# Altium schematic sheet Digital_CPLD.SchDoc
size 381 x 381 mm
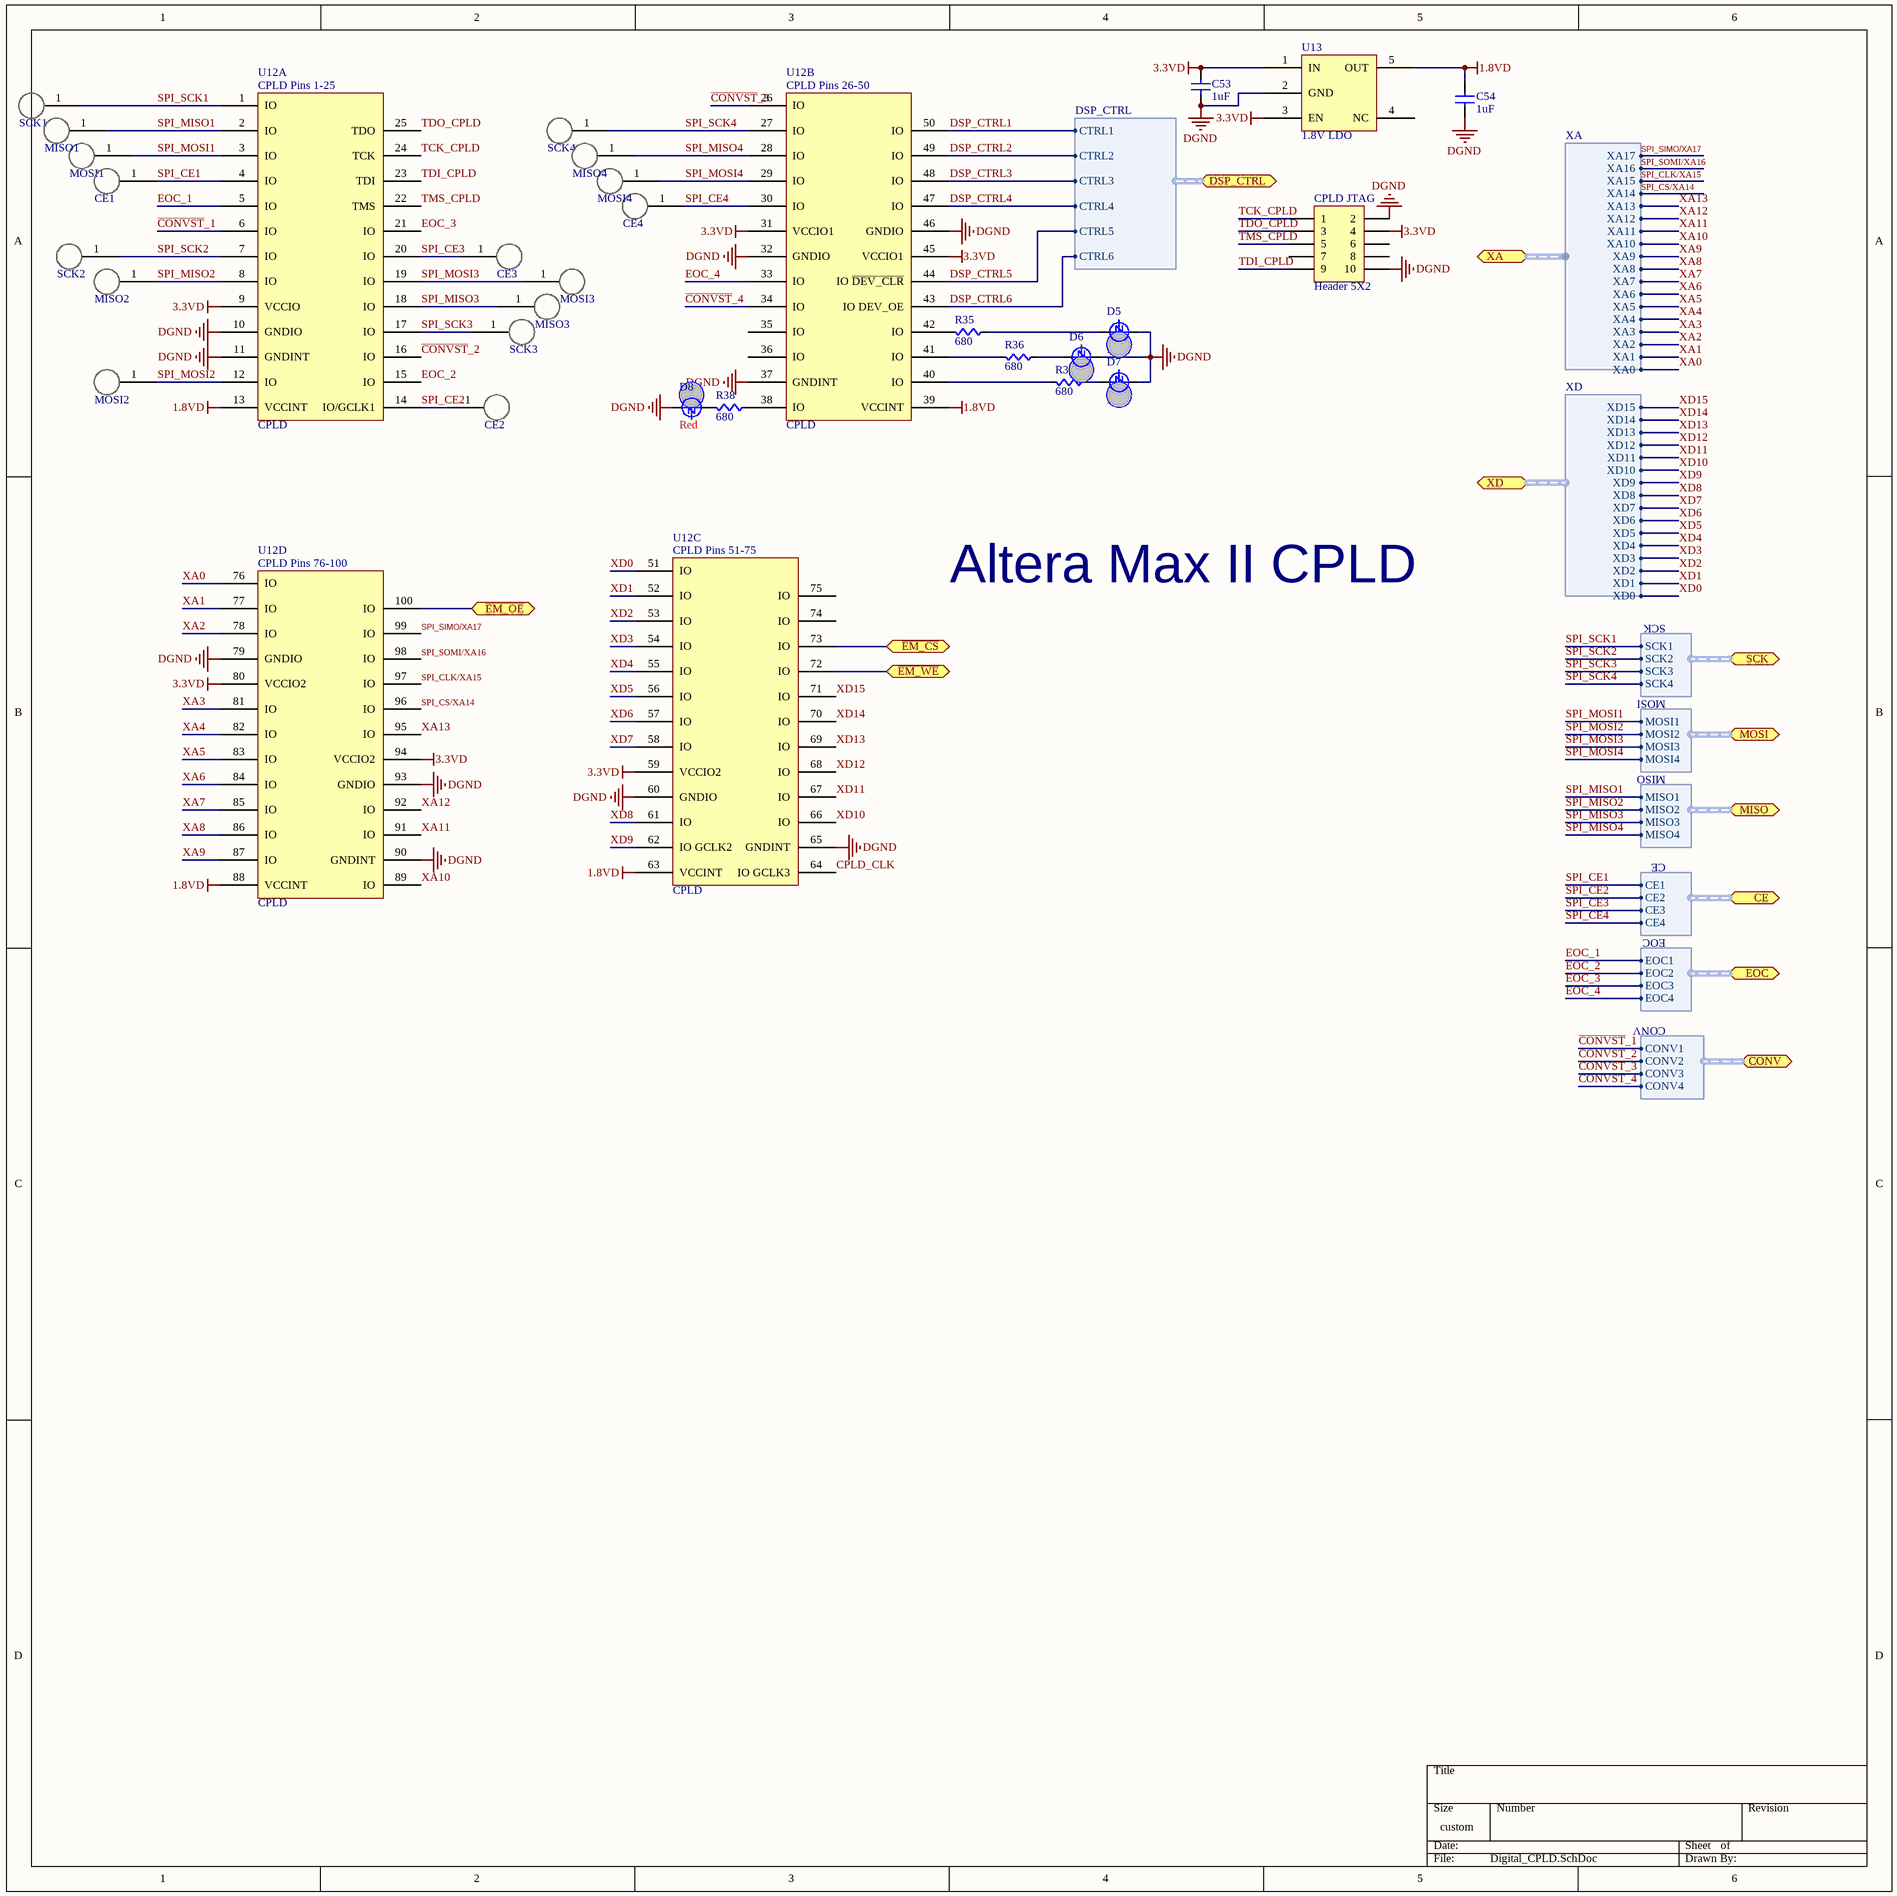
[diagram p0: Digital_CPLD.SchDoc]

## Parts
C53  value 1uF  [CAPC0603]  (hidden comment: Cap)
C54  value 1uF  [CAPC0603]  (hidden comment: Cap)
CE1  Test_Point  [TP]  (value not drawn)
CE2  Test_Point  [TP]  (value not drawn)
CE3  Test_Point  [TP]  (value not drawn)
CE4  Test_Point  [TP]  (value not drawn)
CPLD_JTAG  Header 5X2  [HDR2X5]
D5  Color: Red  [LED0603]  (hidden comment: LED)
D6  Color: Red  [LED0603]  (hidden comment: LED)
D7  Color: Red  [LED0603]  (hidden comment: LED)
D8  Color: Red  [LED0603]  (hidden comment: LED)
MISO1  Test_Point  [TP]  (value not drawn)
MISO2  Test_Point  [TP]  (value not drawn)
MISO3  Test_Point  [TP]  (value not drawn)
MISO4  Test_Point  [TP]  (value not drawn)
MOSI1  Test_Point  [TP]  (value not drawn)
MOSI2  Test_Point  [TP]  (value not drawn)
MOSI3  Test_Point  [TP]  (value not drawn)
MOSI4  Test_Point  [TP]  (value not drawn)
R35  value 680  [RES0603]  (hidden comment: Res)
R36  value 680  [RES0603]  (hidden comment: Res)
R37  value 680  [RES0603]  (hidden comment: Res)
R38  value 680  [RES0603]  (hidden comment: Res)
SCK1  Test_Point  [TP]  (value not drawn)
SCK2  Test_Point  [TP]  (value not drawn)
SCK3  Test_Point  [TP]  (value not drawn)
SCK4  Test_Point  [TP]  (value not drawn)
U12  CPLD  [TQFP-100]  (parts A,B,C,D of 4)
U13  1.8V LDO  [SOT23-5n]

## Ports
CE (harness CE), CONV (harness CONV), DSP_CTRL (harness DSP_CTRL), EOC (harness EOC), MISO (harness MISO), MOSI (harness MOSI), SCK (harness SCK), XA (harness XA), XD (harness XD), ~{EM_CS} (bidir), ~{EM_OE} (bidir), ~{EM_WE} (bidir)

## Harnesses
DSP_CTRL: CTRL1, CTRL2, CTRL3, CTRL4, CTRL5, CTRL6
XA: XA17, XA16, XA15, XA14, XA13, XA12, XA11, XA10, XA9, XA8, XA7, XA6, XA5, XA4, XA3, XA2, XA1, XA0
XD: XD15, XD14, XD13, XD12, XD11, XD10, XD9, XD8, XD7, XD6, XD5, XD4, XD3, XD2, XD1, XD0
CE: CE1, CE2, CE3, CE4
MISO: MISO1, MISO2, MISO3, MISO4
EOC: EOC1, EOC2, EOC3, EOC4
MOSI: MOSI1, MOSI2, MOSI3, MOSI4
SCK: SCK1, SCK2, SCK3, SCK4
CONV: CONV1, CONV2, CONV3, CONV4

## Nets
1.8VD: C54.1(A) U12.13(VCCINT) U12.39(VCCINT) U12.63(VCCINT) U12.88(VCCINT) U13.5(OUT)
3.3VD: C53.1(A) CPLD_JTAG.4 U12.9(VCCIO) U12.31(VCCIO1) U12.45(VCCIO1) U12.59(VCCIO2) U12.80(VCCIO2) U12.94(VCCIO2) U13.1(IN) U13.3(EN)
DGND: C53.2(B) C54.2(B) CPLD_JTAG.2 CPLD_JTAG.10 D5.C D6.C D7.C D8.C U12.10(GNDIO) U12.11(GNDINT) U12.32(GNDIO) U12.37(GNDINT) U12.46(GNDIO) U12.60(GNDIO) U12.65(GNDINT) U12.79(GNDIO) U12.90(GNDINT) U12.93(GNDIO) U13.2(GND)
~{CONVST}_1: U12.6(IO) ; port CONV.CONV1
~{CONVST}_2: U12.16(IO) ; port CONV.CONV2
~{CONVST}_3: U12.26(IO) ; port CONV.CONV3
~{CONVST}_4: U12.34(IO) ; port CONV.CONV4
CPLD_CLK: U12.64(IO_GCLK3)
DSP_CTRL1: U12.50(IO) ; port DSP_CTRL.CTRL1
DSP_CTRL2: U12.49(IO) ; port DSP_CTRL.CTRL2
DSP_CTRL3: U12.48(IO) ; port DSP_CTRL.CTRL3
DSP_CTRL4: U12.47(IO) ; port DSP_CTRL.CTRL4
DSP_CTRL5: U12.44(IO_~{DEV_CLR}) ; port DSP_CTRL.CTRL5
DSP_CTRL6: U12.43(IO_DEV_OE) ; port DSP_CTRL.CTRL6
~{EM_CS}: U12.73(IO) ; port ~{EM_CS}
~{EM_OE}: U12.100(IO) ; port ~{EM_OE}
~{EM_WE}: U12.72(IO) ; port ~{EM_WE}
EOC_1: U12.5(IO) ; port EOC.EOC1
EOC_2: U12.15(IO) ; port EOC.EOC2
EOC_3: U12.21(IO) ; port EOC.EOC3
EOC_4: U12.33(IO) ; port EOC.EOC4
SPI_CE1: CE1.1 U12.4(IO) ; port CE.CE1
SPI_CE2: CE2.1 U12.14(IO/GCLK1) ; port CE.CE2
SPI_CE3: CE3.1 U12.20(IO) ; port CE.CE3
SPI_CE4: CE4.1 U12.30(IO) ; port CE.CE4
SPI_CLK/XA15: U12.97(IO) ; port XA.XA15
SPI_CS/XA14: U12.96(IO) ; port XA.XA14
SPI_MISO1: MISO1.1 U12.2(IO) ; port MISO.MISO1
SPI_MISO2: MISO2.1 U12.8(IO) ; port MISO.MISO2
SPI_MISO3: MISO3.1 U12.18(IO) ; port MISO.MISO3
SPI_MISO4: MISO4.1 U12.28(IO) ; port MISO.MISO4
SPI_MOSI1: MOSI1.1 U12.3(IO) ; port MOSI.MOSI1
SPI_MOSI2: MOSI2.1 U12.12(IO) ; port MOSI.MOSI2
SPI_MOSI3: MOSI3.1 U12.19(IO) ; port MOSI.MOSI3
SPI_MOSI4: MOSI4.1 U12.29(IO) ; port MOSI.MOSI4
SPI_SCK1: SCK1.1 U12.1(IO) ; port SCK.SCK1
SPI_SCK2: SCK2.1 U12.7(IO) ; port SCK.SCK2
SPI_SCK3: SCK3.1 U12.17(IO) ; port SCK.SCK3
SPI_SCK4: SCK4.1 U12.27(IO) ; port SCK.SCK4
SPI_SIMO/XA17: U12.99(IO) ; port XA.XA17
SPI_SOMI/XA16: U12.98(IO) ; port XA.XA16
TCK_CPLD: CPLD_JTAG.1 U12.24(TCK)
TDI_CPLD: CPLD_JTAG.9 U12.23(TDI)
TDO_CPLD: CPLD_JTAG.3 U12.25(TDO)
TMS_CPLD: CPLD_JTAG.5 U12.22(TMS)
XA0: U12.76(IO) ; port XA.XA0
XA1: U12.77(IO) ; port XA.XA1
XA2: U12.78(IO) ; port XA.XA2
XA3: U12.81(IO) ; port XA.XA3
XA4: U12.82(IO) ; port XA.XA4
XA5: U12.83(IO) ; port XA.XA5
XA6: U12.84(IO) ; port XA.XA6
XA7: U12.85(IO) ; port XA.XA7
XA8: U12.86(IO) ; port XA.XA8
XA9: U12.87(IO) ; port XA.XA9
XA10: U12.89(IO) ; port XA.XA10
XA11: U12.91(IO) ; port XA.XA11
XA12: U12.92(IO) ; port XA.XA12
XA13: U12.95(IO) ; port XA.XA13
XD0: U12.51(IO) ; port XD.XD0
XD1: U12.52(IO) ; port XD.XD1
XD2: U12.53(IO) ; port XD.XD2
XD3: U12.54(IO) ; port XD.XD3
XD4: U12.55(IO) ; port XD.XD4
XD5: U12.56(IO) ; port XD.XD5
XD6: U12.57(IO) ; port XD.XD6
XD7: U12.58(IO) ; port XD.XD7
XD8: U12.61(IO) ; port XD.XD8
XD9: U12.62(IO_GCLK2) ; port XD.XD9
XD10: U12.66(IO) ; port XD.XD10
XD11: U12.67(IO) ; port XD.XD11
XD12: U12.68(IO) ; port XD.XD12
XD13: U12.69(IO) ; port XD.XD13
XD14: U12.70(IO) ; port XD.XD14
XD15: U12.71(IO) ; port XD.XD15
NetD5_A: D5.A R35.2(B)
NetD6_A: D6.A R36.2(B)
NetD7_A: D7.A R37.2(B)
NetD8_A: D8.A R38.1(A)
NetR35_1: R35.1(A) U12.42(IO)
NetR36_1: R36.1(A) U12.41(IO)
NetR37_1: R37.1(A) U12.40(IO)
NetR38_2: R38.2(B) U12.38(IO)

Not connected (* = marked no-connect by the designer): CPLD_JTAG 6 7 8; U12 35(IO) 36(IO) 74(IO) 75(IO); U13 4(NC)

## Notes on the sheet
- Altera Max II CPLD
- (in symbol EPM240GT100I5N, part A) CPLD Pins 1-25
- (in symbol EPM240GT100I5N, part B) CPLD Pins 26-50
- (in symbol EPM240GT100I5N, part C) CPLD Pins 51-75
- (in symbol EPM240GT100I5N, part D) CPLD Pins 76-100

## Library data of the parts
CE1-CE4 MISO1-MISO4 MOSI1-MOSI4 SCK1-SCK4 = Test_Point: TEST POINT PC COMPACT .063"D; Supplier 1: Digi-Key; Supplier Part Number 1: 5006K-ND
CPLD_JTAG = Header 5X2: Header, 5-Pin, Dual row; LatestRevisionDate: 17-Jul-2002; LatestRevisionNote: Re-released for DXP Platform.; Publisher: Altium Limited
U12 = EPM240GT100I5N: IC CPLD 192MC 4.7NS 100TQFP; Supplier 1: Digi-Key; Supplier Part Number 1: 544-2275-ND
U13 = LP5907: IC REG LDO 1.8V 0.25A SOT23-5; Supplier 1: Digi-Key; Supplier Part Number 1: 296-41463-2-ND
C53 C54 = Cap: Supplier 1: Digi-Key; Supplier Part Number 1: 1276-1000-1-ND
D5-D8 = LED: Supplier 1: Digi-Key; Supplier Part Number 1: 754-1122-1-ND
R35-R38 = Res: Supplier 1: Digi-Key; Supplier Part Number 1: RMCF0603JT10K0CT-ND